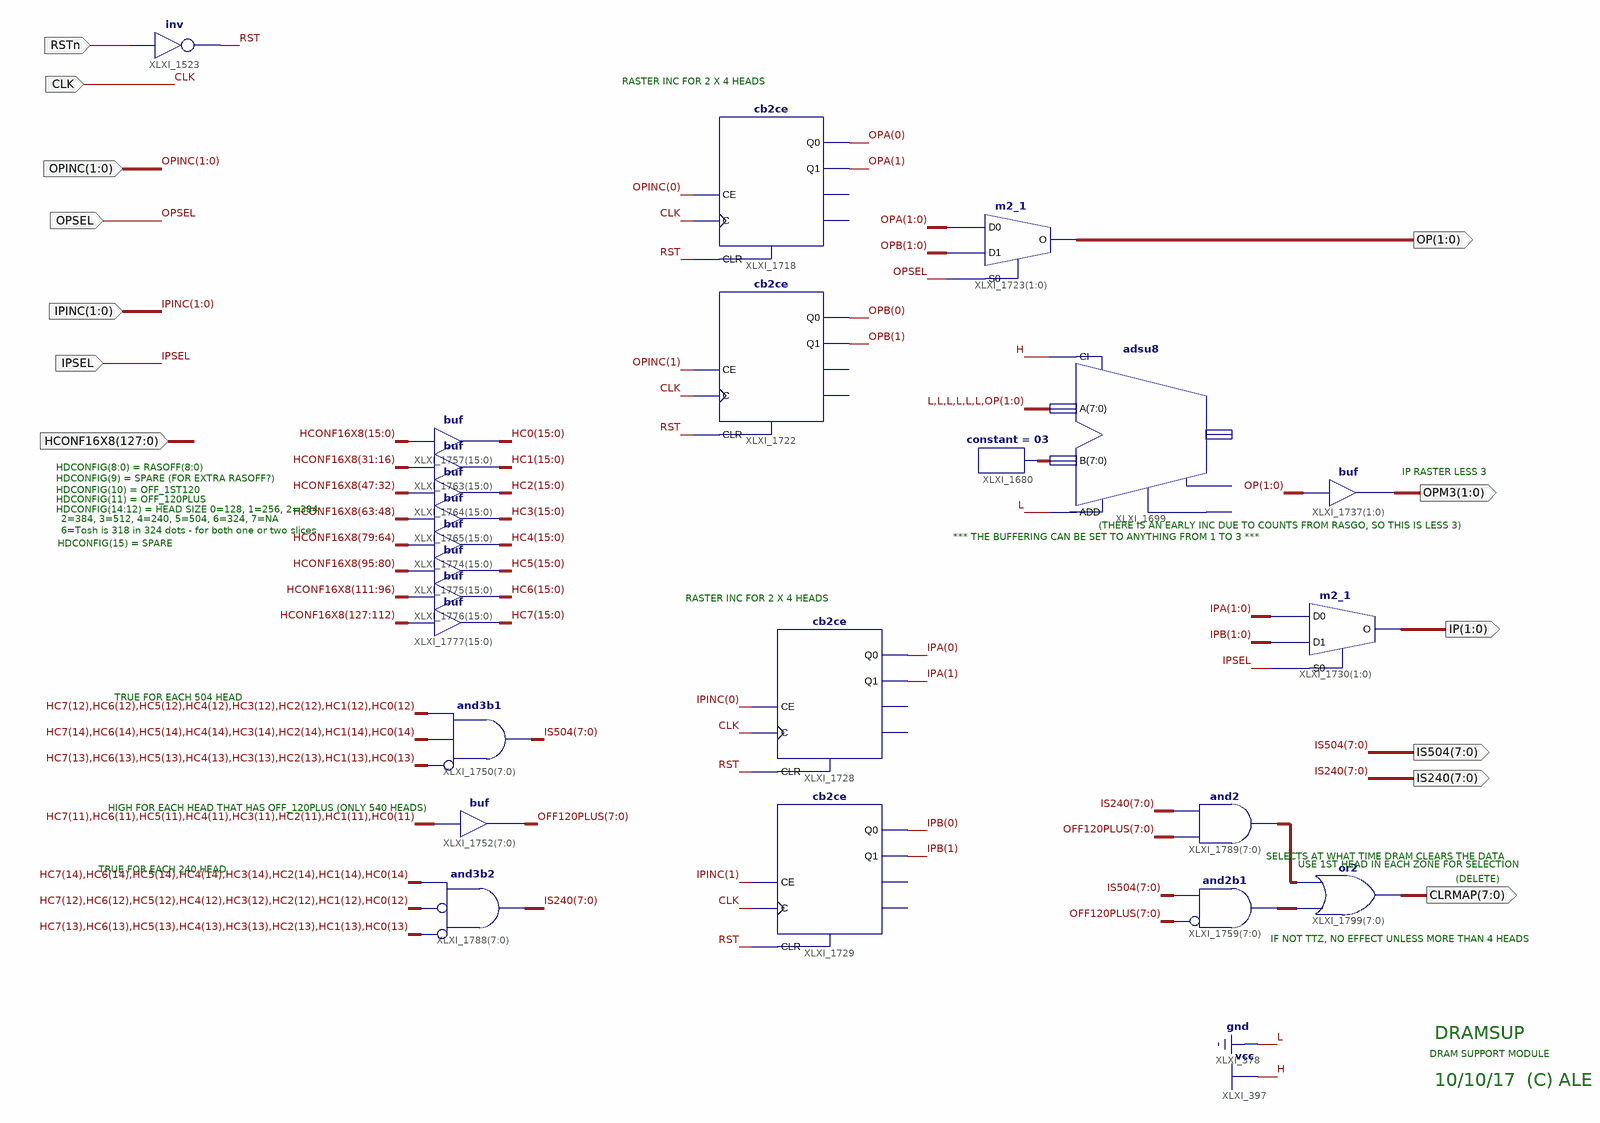
[diagram p0: schematic sheet 1]
// Xilinx ISE schematic DramSup.sch (zynq) as structural Verilog: 24 symbols, 13 ports
module DramSup (
  input  CLK,
  input  RSTn,
  input  [1:0] OPINC,
  input  OPSEL,
  input  [1:0] IPINC,
  input  IPSEL,
  input  [127:0] HCONF16X8,
  output [1:0] OP,
  output [1:0] OPM3,
  output [1:0] IP,
  output [7:0] IS504,
  output [7:0] IS240,
  output [7:0] CLRMAP
);

  wire RST;
  wire [1:0] IPA, IPB, OPA, OPB;
  wire [7:0] OFF120PLUS, XLXN_155, XLXN_266, XLXN_267;
  wire [15:0] HC0, HC1, HC2, HC3, HC4, HC5, HC6, HC7;

  not XLXI_1523 (RST, RSTn);
  cb2ce XLXI_1718 (.C(CLK), .CE(OPINC[0]), .CLR(RST), .Q0(OPA[0]), .Q1(OPA[1]));  // open: CEO, TC
  cb2ce XLXI_1722 (.C(CLK), .CE(OPINC[1]), .CLR(RST), .Q0(OPB[0]), .Q1(OPB[1]));  // open: CEO, TC
  m2_1 XLXI_1723[1:0] (.D0(OPA), .D1(OPB), .S0(OPSEL), .O(OP));
  constant #(.CValue("03")) XLXI_1680 (.O(XLXN_155));
  adsu8 XLXI_1699 (.A({{6{1'b0}}, OP}), .ADD(1'b0), .B(XLXN_155), .CI(1'b1));  // open: CO, OFL, S
  assign OPM3 = OP;  // buf XLXI_1737[1..0], 2 bits wide
  m2_1 XLXI_1730[1:0] (.D0(IPA), .D1(IPB), .S0(IPSEL), .O(IP));
  assign HC0 = HCONF16X8[15:0];  // buf XLXI_1757[15..0], 16 bits wide
  assign HC1 = HCONF16X8[31:16];  // buf XLXI_1763[15..0], 16 bits wide
  assign HC2 = HCONF16X8[47:32];  // buf XLXI_1764[15..0], 16 bits wide
  assign HC3 = HCONF16X8[63:48];  // buf XLXI_1765[15..0], 16 bits wide
  assign HC4 = HCONF16X8[79:64];  // buf XLXI_1774[15..0], 16 bits wide
  assign HC5 = HCONF16X8[95:80];  // buf XLXI_1775[15..0], 16 bits wide
  assign HC6 = HCONF16X8[111:96];  // buf XLXI_1776[15..0], 16 bits wide
  assign HC7 = HCONF16X8[127:112];  // buf XLXI_1777[15..0], 16 bits wide
  assign IS504 = ~{HC7[13], HC6[13], HC5[13], HC4[13], HC3[13], HC2[13], HC1[13], HC0[13]} & {HC7[14], HC6[14], HC5[14], HC4[14], HC3[14], HC2[14], HC1[14], HC0[14]} & {HC7[12], HC6[12], HC5[12], HC4[12], HC3[12], HC2[12], HC1[12], HC0[12]};  // and3b1 XLXI_1750[7..0], 8 bits wide
  assign OFF120PLUS = {HC7[11], HC6[11], HC5[11], HC4[11], HC3[11], HC2[11], HC1[11], HC0[11]};  // buf XLXI_1752[7..0], 8 bits wide
  assign IS240 = ~{HC7[13], HC6[13], HC5[13], HC4[13], HC3[13], HC2[13], HC1[13], HC0[13]} & ~{HC7[12], HC6[12], HC5[12], HC4[12], HC3[12], HC2[12], HC1[12], HC0[12]} & {HC7[14], HC6[14], HC5[14], HC4[14], HC3[14], HC2[14], HC1[14], HC0[14]};  // and3b2 XLXI_1788[7..0], 8 bits wide
  cb2ce XLXI_1728 (.C(CLK), .CE(IPINC[0]), .CLR(RST), .Q0(IPA[0]), .Q1(IPA[1]));  // open: CEO, TC
  cb2ce XLXI_1729 (.C(CLK), .CE(IPINC[1]), .CLR(RST), .Q0(IPB[0]), .Q1(IPB[1]));  // open: CEO, TC
  assign CLRMAP = XLXN_266 | XLXN_267;  // or2 XLXI_1799[7..0], 8 bits wide
  assign XLXN_266 = ~OFF120PLUS & IS504;  // and2b1 XLXI_1759[7..0], 8 bits wide
  assign XLXN_267 = OFF120PLUS & IS240;  // and2 XLXI_1789[7..0], 8 bits wide

  // Notes on the sheet:
  //   RASTER INC FOR 2 X 4 HEADS
  //   HDCONFIG(8:0) = RASOFF(8:0)
  //   IP RASTER LESS 3
  //   HDCONFIG(9) = SPARE (FOR EXTRA RASOFF?)
  //   HDCONFIG(10) = OFF_1ST120
  //   HDCONFIG(11) = OFF_120PLUS
  //   HDCONFIG(14:12) = HEAD SIZE 0=128, 1=256, 2=384
  //   2=384, 3=512, 4=240, 5=504, 6=324, 7=NA
  //   (THERE IS AN EARLY INC DUE TO COUNTS FROM RASGO, SO THIS IS LESS 3)
  //   6=Tosh is 318 in 324 dots - for both one or two slices
  //   *** THE BUFFERING CAN BE SET TO ANYTHING FROM 1 TO 3 ***
  //   HDCONFIG(15) = SPARE
  //   RASTER INC FOR 2 X 4 HEADS
  //   TRUE FOR EACH 504 HEAD
  //   HIGH FOR EACH HEAD THAT HAS OFF_120PLUS (ONLY 540 HEADS)
  //   SELECTS AT WHAT TIME DRAM CLEARS THE DATA
  //   USE 1ST HEAD IN EACH ZONE FOR SELECTION
  //   TRUE FOR EACH 240 HEAD
  //   (DELETE)
  //   IF NOT TTZ, NO EFFECT UNLESS MORE THAN 4 HEADS
  //   DRAMSUP
  //   DRAM SUPPORT MODULE
  //   10/10/17  (C) ALE
endmodule
